# Altium project rs422-adapter.PrjPcb
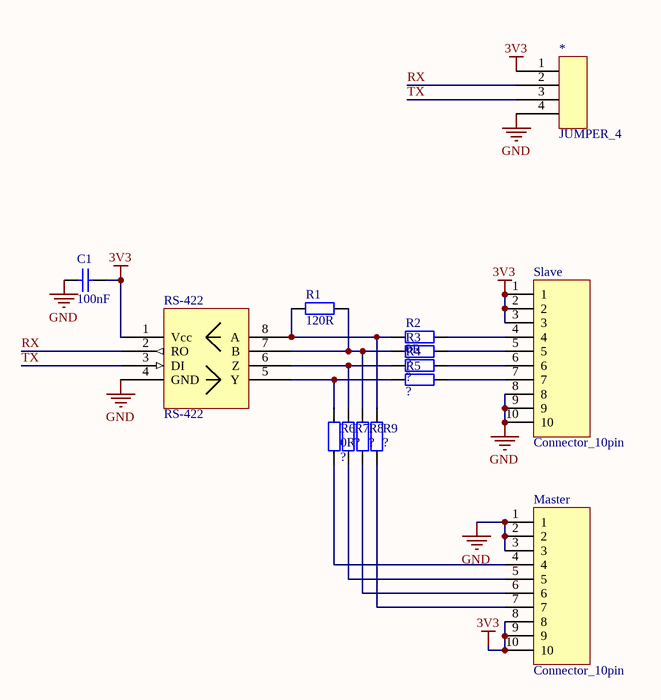
[diagram p0: main.SchDoc]
1 sheet, 14 parts. Net scope: global (net labels, ports and power ports of the same name join across sheets).
Board file: main.PcbDoc

## Sheet main.SchDoc
size A

### Parts
*  JUMPER_4  [JUMPER_4]
C1  100nF  [FP_0805_CAP_085]
Master  Connector_10pin  [FP_CONN10_SZK_ALLO]
R1  120R  [FP_0805_RES]
R2  0R  [FP_0805_RES]
R3  0R  [FP_0805_RES]  (value not drawn)
R4  0R  [FP_0805_RES]  (value not drawn)
R5  0R  [FP_0805_RES]  (value not drawn)
R6  0R  [FP_0805_RES]
R7  0R  [FP_0805_RES]  (value not drawn)
R8  0R  [FP_0805_RES]  (value not drawn)
R9  0R  [FP_0805_RES]  (value not drawn)
RS-422  RS-422  [NSOIC-8]
Slave  Connector_10pin  [FP_CONN10_SZK_ALLO]

### Nets
3V3: *.1 C1.1 Master.8 Master.9 Master.10 RS-422.1(Vcc) Slave.1 Slave.2 Slave.3
GND: *.4 C1.2 Master.1 Master.2 Master.3 RS-422.4(GND) Slave.8 Slave.9 Slave.10
RX: *.2 RS-422.2(RO)
TX: *.3 RS-422.3(DI)
NetMaster_4: Master.4 R6.1
NetMaster_5: Master.5 R7.1
NetMaster_6: Master.6 R8.1
NetMaster_7: Master.7 R9.1
NetR1_1: R1.1 R2.1 R9.2 RS-422.8(A)
NetR1_2: R1.2 R3.1 R8.2 RS-422.7(B)
NetR2_2: R2.2 Slave.4
NetR3_2: R3.2 Slave.5
NetR4_1: R4.1 R7.2 RS-422.6(Z)
NetR4_2: R4.2 Slave.6
NetR5_1: R5.1 R6.2 RS-422.5(Y)
NetR5_2: R5.2 Slave.7

### Library data of the parts
C1 = CAP 100nF: Capacitor; Tolerance: +80%/-20%; Voltage: 25V; Reference: 1759167; Name: SMD Multilayer Ceramic Capacitor, 0805; Supplier: Farnell; Value: 100nF
R1 = RES 120R: Resistor; Tolerance: 5%; Power: 125mW; Name: YAGEO (PHYCOMP)  RC0805JR-07120RL  SMD Chip Resistor, Thick Film, 120 ohm; Reference: 9233890; Supplier: Farnell; Value: 120R
R2-R9 = RES: Resistor; Value: ?
RS-422 = ISL83071: RS-422 transceiver 3V3